# EAGLE board ME461_F28379D (EAGLE 7.7.0), part 1 of 2
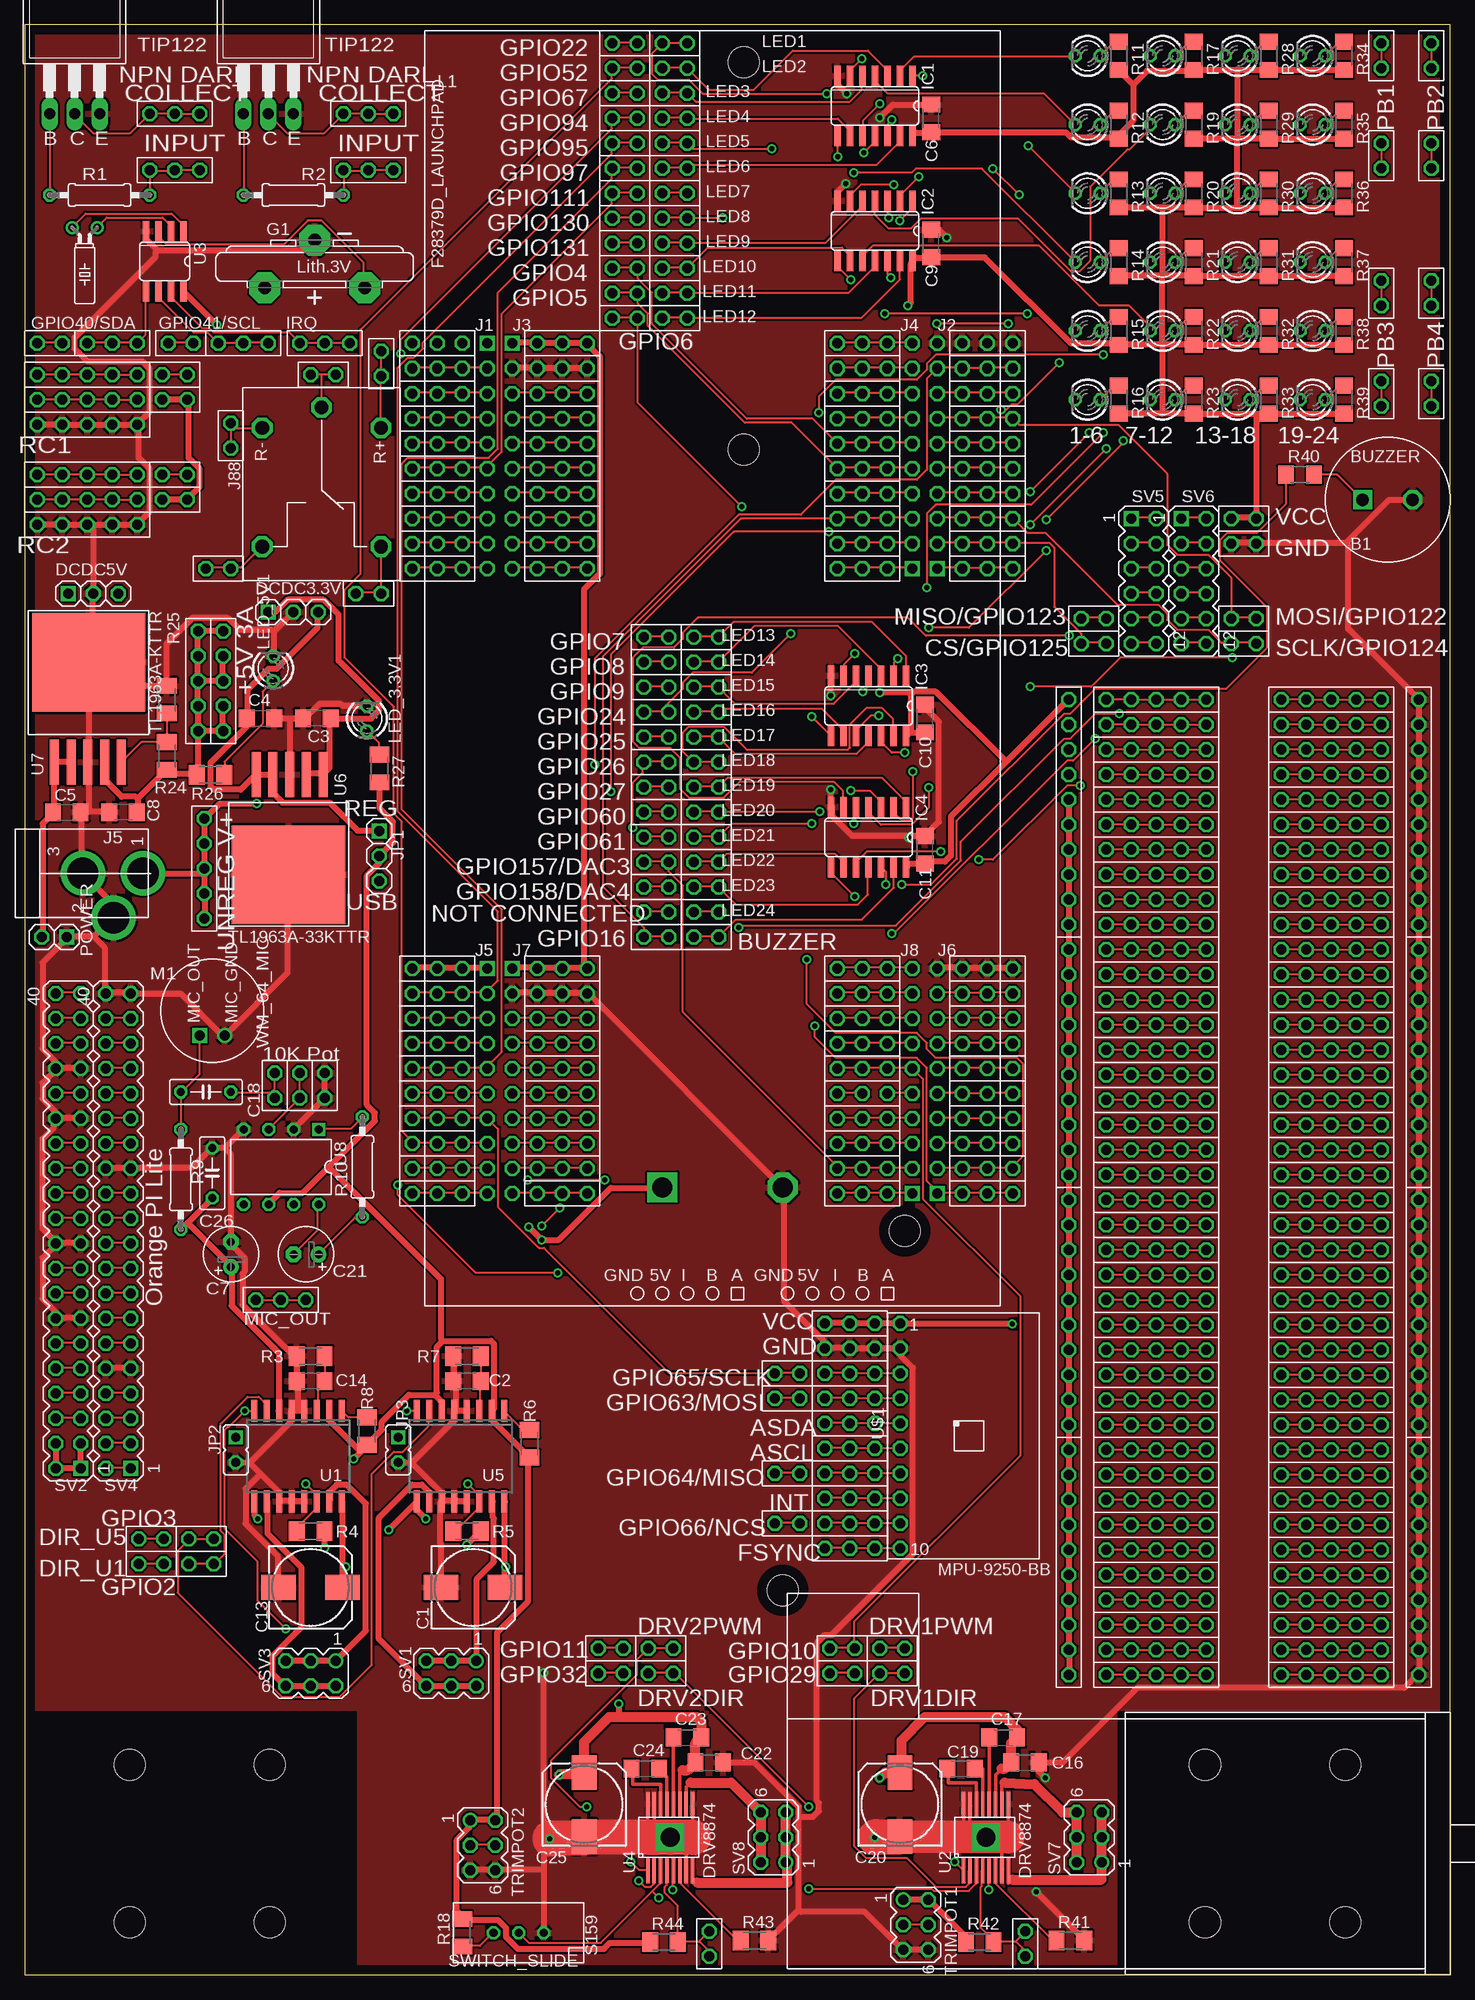
[diagram p5: board, top side]
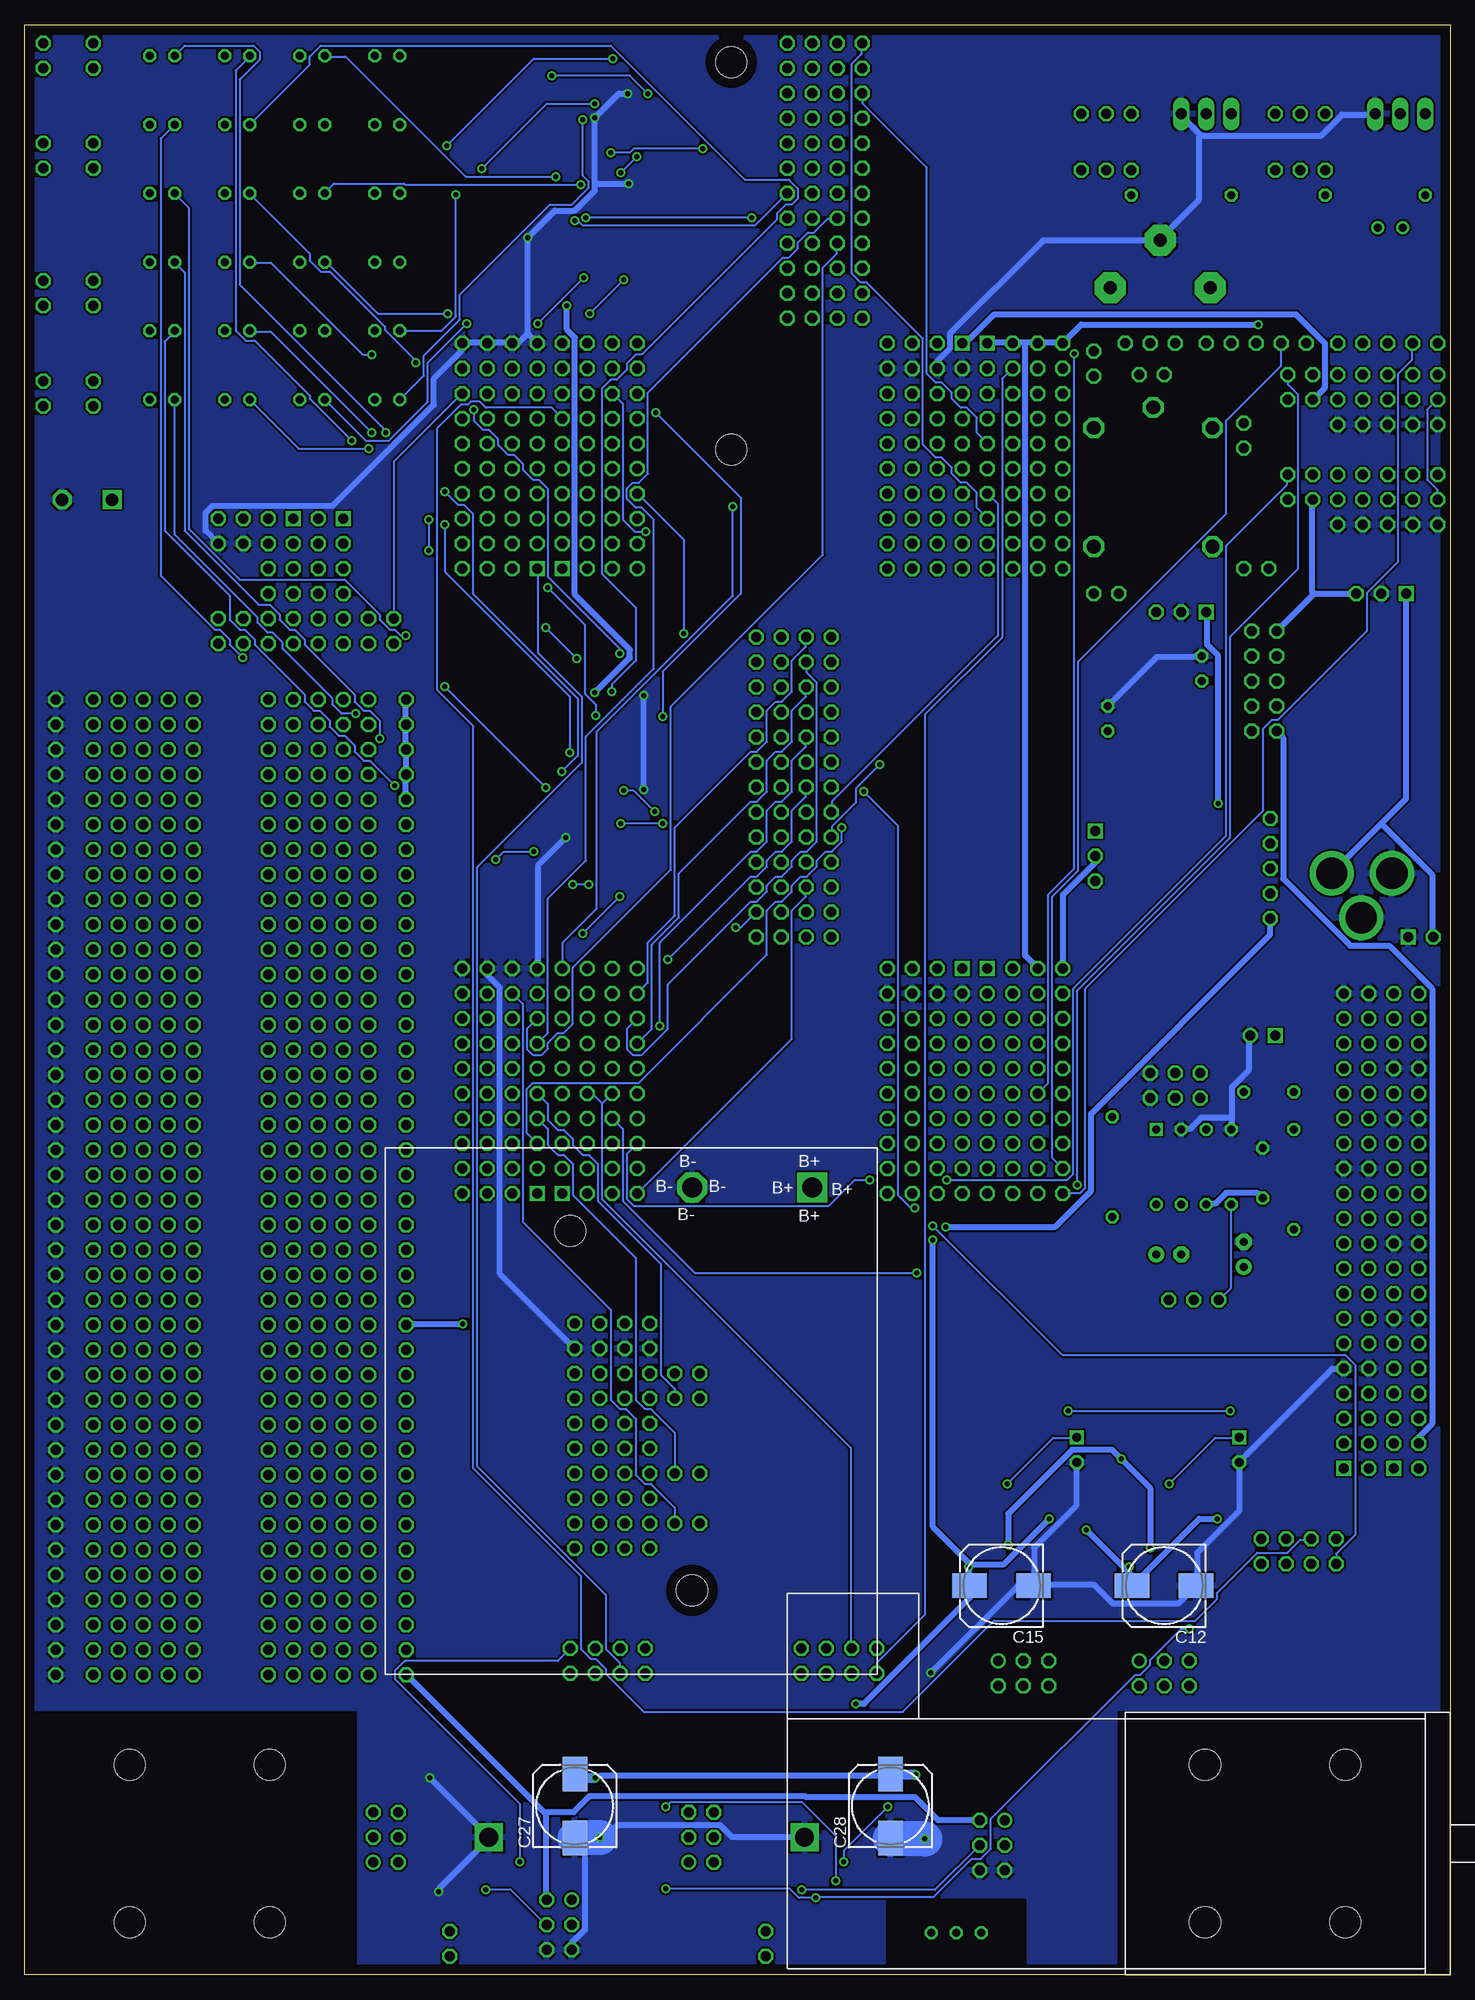
[diagram p6: board, bottom side, seen from below]

Size 144.78 x 198.12 mm. Coordinates in mm from the lower left corner, seen from the top.
Outline: 0,0 144.78,0 144.78,198.12 0,198.12 0,0
Copper layers (1*16): Top 0.035mm / dielectric 1.5mm / Bottom 0.035mm
Design rules "default *": minimum track width 7mil, minimum drill 20mil, track to track 8mil, track to pad 8mil, pad to pad 8mil, via to via 8mil, smd to smd 8mil, copper to edge 40mil, drill to drill 8mil, minimum pad ring 10mil, minimum via ring 8mil, stop-mask expansion 4mil, vias tented up to drill 20mil, thermal gap 10mil
Net classes: 0 default: width 0.203 mm, drill 0.508 mm, clearance 0.203 mm; 1 supply: width 0.61 mm, drill 0.508 mm, clearance 0.203 mm
tRestrict: area 0,0 to 33.7,26.7; area 111.1,0 to 144.8,26.7
bRestrict: area 43.2,0 to 57.1,7.6; area 111.1,0 to 144.8,26.7; area 0,0 to 33.7,26.7

## Footprints (pad centres in the part's own frame; a part is rotated, then mirrored left to right if it is on the bottom)
BUZZER = drill 1.27 square: P$1 -2.54,0 | drill 1.27 octagon: P$2 2.54,0
BATTERY_4AA_HOLDER = drill 2.032 square: P$1 0,0 | drill 2.032 octagon: P$2 12.224,0 | hole 3.175: 12.224,40.958; 24.606,4.445
153CLV-0810 = smd 3.5 x 2.5: + 3.25,0; - -3.25,0
C1206 = smd 1.6 x 1.8: 1 -1.4,0; 2 1.4,0
E2,5-6 = drill 0.813 pad 1.6: + -1.27,0 | drill 0.813 pad 1.6 octagon: - 1.27,0
C050-025X075 = drill 0.813 octagon: 1 -2.54,0; 2 2.54,0
1X03 = drill 1.016 square: 1 -2.54,0 | drill 1.016 octagon: 2 0,0; 3 2.54,0
CR2032V = drill 1.321 pad 3.15 octagon: + -2.54,-5.08; +@1 -2.54,5.08; - 2.286,0
SO14 = smd 0.66 x 2.032: 1 -3.81,-3.073; 2 -2.54,-3.073; 3 -1.27,-3.073; 4 0,-3.073; 5 1.27,-3.073; 6 2.54,-3.073; 7 3.81,-3.073; 8 3.81,3.073; 9 2.54,3.073; 10 1.27,3.073; 11 0,3.073; 12 -1.27,3.073; 13 -2.54,3.073; 14 -3.81,3.073
STRIP3 = drill 1.016 octagon: P$1 0,0; P$2 2.54,0; P$3 5.08,0
JACK-PMS = drill 3.175 pad 4.5: 1 -0.5,-3.31; 2 -5,-0.31; 3 -0.5,2.809
STRIP2 = drill 1.016 octagon: P$1 0,0; P$2 2.54,0
RELAY_JQC-3F_5V = drill 1.397 octagon: P$1 0,0; P$2 2.064,6.032; P$3 14.129,6.032; P$4 14.129,-6.032; P$5 2.064,-6.032
JP1 = drill 0.914 square: 1 0,-1.27 | drill 0.914 octagon: 2 0,1.27
F28379D_LAUNCHPAD = drill 1.016 square: P$1 -24.13,33.02; P$11 21.59,10.16; P$21 -21.59,33.02; P$31 19.05,10.16; P$41 -24.13,-30.48; P$51 21.59,-53.34; P$61 -21.59,-30.48; P$71 19.05,-53.34 | drill 1.016 octagon: P$2 -24.13,30.48; P$3 -24.13,27.94; P$4 -24.13,25.4; P$5 -24.13,22.86; P$6 -24.13,20.32; P$7 -24.13,17.78; P$8 -24.13,15.24; P$9 -24.13,12.7; P$10 -24.13,10.16; P$12 21.59,12.7; P$13 21.59,15.24; P$14 21.59,17.78; P$15 21.59,20.32; P$16 21.59,22.86; P$17 21.59,25.4; P$18 21.59,27.94; P$19 21.59,30.48; P$20 21.59,33.02; P$22 -21.59,30.48; P$23 -21.59,27.94; P$24 -21.59,25.4; P$25 -21.59,22.86; P$26 -21.59,20.32; P$27 -21.59,17.78; P$28 -21.59,15.24; P$29 -21.59,12.7; P$30 -21.59,10.16; P$32 19.05,12.7; P$33 19.05,15.24; P$34 19.05,17.78; P$35 19.05,20.32; P$36 19.05,22.86; P$37 19.05,25.4; P$38 19.05,27.94; P$39 19.05,30.48; P$40 19.05,33.02; P$42 -24.13,-33.02; P$43 -24.13,-35.56; P$44 -24.13,-38.1; P$45 -24.13,-40.64; P$46 -24.13,-43.18; P$47 -24.13,-45.72; P$48 -24.13,-48.26; P$49 -24.13,-50.8; P$50 -24.13,-53.34; P$52 21.59,-50.8; P$53 21.59,-48.26; P$54 21.59,-45.72; P$55 21.59,-43.18; P$56 21.59,-40.64; P$57 21.59,-38.1; P$58 21.59,-35.56; P$59 21.59,-33.02; P$60 21.59,-30.48; P$62 -21.59,-33.02; P$63 -21.59,-35.56; P$64 -21.59,-38.1; P$65 -21.59,-40.64; P$66 -21.59,-43.18; P$67 -21.59,-45.72; P$68 -21.59,-48.26; P$69 -21.59,-50.8; P$70 -21.59,-53.34; P$72 19.05,-50.8; P$73 19.05,-48.26; P$74 19.05,-45.72; P$75 19.05,-43.18; P$76 19.05,-40.64; P$77 19.05,-38.1; P$78 19.05,-35.56; P$79 19.05,-33.02; P$80 19.05,-30.48
LED3MM = drill 0.813 octagon: A -1.27,0; K 1.27,0
WM_64_MIC = drill 1.016 square: P$1 0,0 | drill 1.016: P$2 2.54,0
1X02 = drill 1.016 square: 1 -1.27,0 | drill 1.016 octagon: 2 1.27,0
TC26H = drill 0.813: 1 -1.27,0; 2 1.27,0
0207/10 = drill 0.813 octagon: 1 -5.08,0; 2 5.08,0
M1206 = smd 1.6 x 2: 1 -1.4,0; 2 1.4,0
R1206 = smd 1.6 x 1.803: 1 -1.422,0; 2 1.422,0
STRIP5 = drill 1.016 octagon: P$1 0,0; P$2 2.54,0; P$3 5.08,0; P$4 7.62,0; P$5 10.16,0
STRIP10 = drill 1.016 octagon: P$1 0,0; P$2 2.54,0; P$3 5.08,0; P$4 7.62,0; P$5 10.16,0; P$6 12.7,0; P$7 15.24,0; P$8 17.78,0; P$9 20.32,0; P$10 22.86,0
SWITCH_SLIDE = drill 0.813 octagon: P$1 0,-5.08; P$2 0,-2.54; P$3 0,0
MA03-2 = drill 1.016: 1 -2.54,-1.27 | drill 1.016 octagon: 2 -2.54,1.27; 3 0,-1.27; 4 0,1.27; 5 2.54,-1.27; 6 2.54,1.27
MA20-2 = drill 1.016 square: 1 -24.13,-1.27 | drill 1.016 octagon: 2 -24.13,1.27; 3 -21.59,-1.27; 4 -21.59,1.27; 5 -19.05,-1.27; 6 -19.05,1.27; 7 -16.51,-1.27; 8 -16.51,1.27; 9 -13.97,-1.27; 10 -13.97,1.27; 11 -11.43,-1.27; 12 -11.43,1.27; 13 -8.89,-1.27; 14 -8.89,1.27; 15 -6.35,-1.27; 16 -6.35,1.27; 17 -3.81,-1.27; 18 -3.81,1.27; 19 -1.27,-1.27; 20 -1.27,1.27; 21 1.27,-1.27; 22 1.27,1.27; 23 3.81,-1.27; 24 3.81,1.27; 25 6.35,-1.27; 26 6.35,1.27; 27 8.89,-1.27; 28 8.89,1.27; 29 11.43,-1.27; 30 11.43,1.27; 31 13.97,-1.27; 32 13.97,1.27; 33 16.51,-1.27; 34 16.51,1.27; 35 19.05,-1.27; 36 19.05,1.27; 37 21.59,-1.27; 38 21.59,1.27; 39 24.13,-1.27; 40 24.13,1.27
MA06-2 = drill 1.016 square: 1 -6.35,-1.27 | drill 1.016 octagon: 2 -6.35,1.27; 3 -3.81,-1.27; 4 -3.81,1.27; 5 -1.27,-1.27; 6 -1.27,1.27; 7 1.27,-1.27; 8 1.27,1.27; 9 3.81,-1.27; 10 3.81,1.27; 11 6.35,-1.27; 12 6.35,1.27
TO220 = drill 1.118 long: 1 -2.54,-6.35; 2 0,-6.35; 3 2.54,-6.35
SO16W = smd 0.6 x 2.2: 1 -4.445,-4.6; 2 -3.175,-4.6; 3 -1.905,-4.6; 4 -0.635,-4.6; 5 0.635,-4.6; 6 1.905,-4.6; 7 3.175,-4.6; 8 4.445,-4.6; 9 4.445,4.6; 10 3.175,4.6; 11 1.905,4.6; 12 0.635,4.6; 13 -0.635,4.6; 14 -1.905,4.6; 15 -3.175,4.6; 16 -4.445,4.6
HTSSOP16 = smd 2.5 x 0.35: P$1 -3.4,2.275; P$2 -3.4,1.625; P$3 -3.4,0.975; P$4 -3.4,0.325; P$5 -3.4,-0.325; P$6 -3.4,-0.975; P$7 -3.4,-1.625; P$8 -3.4,-2.275; P$9 3.4,-2.275; P$10 3.4,-1.625; P$11 3.4,-0.975; P$12 3.4,-0.325; P$13 3.4,0.325; P$14 3.4,0.975; P$15 3.4,1.625; P$16 3.4,2.275 | drill 1.905 pad 2.54 square: P$17 0,0
SO08 = smd 0.66 x 2.032: 1 -1.905,-3.073; 2 -0.635,-3.073; 3 0.635,-3.073; 4 1.905,-3.073; 5 1.905,3.073; 6 0.635,3.073; 7 -0.635,3.073; 8 -1.905,3.073
TL1963AKTTR = smd 0.914 x 4.572: P$1 -3.81,-10.16; P$2 -2.108,-10.16; P$3 -0.406,-10.16; P$4 1.295,-10.16; P$5 2.997,-10.16 | smd 11.5 x 10: P$6 -0.3,0
DIL08 = drill 0.813 square: 1 -3.81,-3.81 | drill 0.813 octagon: 2 -1.27,-3.81; 3 1.27,-3.81; 4 3.81,-3.81; 5 3.81,3.81; 6 1.27,3.81; 7 -1.27,3.81; 8 -3.81,3.81
MPU-9250-BB = drill 1.016 octagon: 1 -11.434,-6.96; 2 -8.894,-6.96; 3 -6.354,-6.96; 4 -3.814,-6.96; 5 -1.274,-6.96; 6 1.266,-6.96; 7 3.806,-6.96; 8 6.346,-6.96; 9 8.886,-6.96; 10 11.426,-6.96
GEARMOTOR_MOUNT = hole 3.175: 7.112,8.001; -7.112,8.001; -7.112,-8.001; 7.112,-8.001
CASTERWHEEL = hole 3.175: 19.685,0; -19.685,0

## Placement (x,y rotation side)
B1  BUZZER  [BUZZER]  138.43,149.86 0 top
B2  BATTERY_4AA_HOLDER  [BATTERY_4AA_HOLDER]  64.77,80.01 180 bottom
C1  47uF  [153CLV-0810]  45.56,39.36 0 top
C2  680pF  [C1206]  44.92,60.32 180 top
C3  10 uF  [C1206]  29.68,127.64 180 top
C4  10 uF  [C1206]  23.96,127.64 0 top
C5  10 uF  [C1206]  4.28,118.12 0 top
C6  0.1uf  [C1206]  92.08,188.59 90 top
C7  10uF  [E2,5-6]  20.96,73.19 90 top
C8  10 uF  [C1206]  9.99,118.12 180 top
C9  0.1uf  [C1206]  92.08,175.9 90 top
C10  0.1uf  [C1206]  91.44,127.64 90 top
C11  0.1uf  [C1206]  91.44,114.3 90 top
C12  47uF  [153CLV-0810]  29.05,39.53 180 bottom
C13  47uF  [153CLV-0810]  29.05,39.36 0 top
C14  680pF  [C1206]  29.05,60.32 180 top
C15  47uF  [153CLV-0810]  45.56,39.53 180 bottom
C16  0.1uF  [C1206]  101.6,21.59 0 top
C17  0.1uF  [C1206]  99.38,24.13 0 top
C18  0.22uF  [C050-025X075]  18.42,89.7 0 top
C19  22nF  [C1206]  95.09,20.95 0 top
C20  47uF  [153CLV-0810]  88.9,17.3 90 top
C21  10uF  [E2,5-6]  28.58,73.19 180 top
C22  0.1uF  [C1206]  69.53,21.59 0 top
C23  0.1uF  [C1206]  67.31,24.13 0 top
C24  22nF  [C1206]  63.02,20.95 0 top
C25  47uF  [153CLV-0810]  56.83,17.3 90 top
C26  0.1uF  [C050-025X075]  19.06,81.45 90 top
C27  47uF  [153CLV-0810]  88.9,17.14 90 bottom
C28  47uF  [153CLV-0810]  56.83,17.14 90 bottom
DCDC3.3V  [1X03]  27.3,138.43 0 top
DCDC5V  [1X03]  6.99,140.34 0 top
G1  CR2032V  [CR2032V]  29.46,173.95 90 top
IC1  7404D  [SO14]  86.36,189.87 180 top
IC2  7404D  [SO14]  86.36,177.16 180 top
IC3  7404D  [SO14]  85.72,128.91 180 top
IC4  7404D  [SO14]  85.72,115.57 180 top
J1  STRIP3  [STRIP3]  27.94,165.74 0 top
J2  STRIP3  [STRIP3]  19.68,165.74 0 top
J3  STRIP3  [STRIP3]  6.35,165.74 0 top
J4  STRIP3  [STRIP3]  12.69,189.06 0 top
J5  [JACK-PMS]  8.72,112.4 90 top
J6  STRIP3  [STRIP3]  12.69,183.35 0 top
J7  STRIP2  [STRIP2]  25.41,91.61 270 top
J8  STRIP2  [STRIP2]  27.95,91.61 270 top
J9  STRIP2  [STRIP2]  30.49,91.61 270 top
J10  STRIP3  [STRIP3]  39.37,165.74 0 top
J11  STRIP2  [STRIP2]  64.77,178.44 0 top
J12  STRIP2  [STRIP2]  64.77,175.9 0 top
J13  STRIP2  [STRIP2]  64.77,173.35 0 top
J14  STRIP3  [STRIP3]  39.37,163.19 0 top
J15  STRIP3  [STRIP3]  39.37,160.66 0 top
J16  STRIP3  [STRIP3]  39.37,158.12 0 top
J17  STRIP3  [STRIP3]  39.37,155.57 0 top
J18  STRIP3  [STRIP3]  39.37,153.03 0 top
J19  STRIP3  [STRIP3]  39.37,150.5 0 top
J20  STRIP3  [STRIP3]  39.37,147.96 0 top
J21  STRIP3  [STRIP3]  39.37,145.41 0 top
J22  STRIP2  [STRIP2]  64.77,170.81 0 top
J23  STRIP3  [STRIP3]  32.38,189.06 0 top
J24  STRIP3  [STRIP3]  32.38,183.35 0 top
J25  STRIP2  [STRIP2]  64.77,168.28 0 top
J26  STRIP2  [STRIP2]  64.77,180.97 0 top
J27  STRIP2  [STRIP2]  67.94,133.35 0 top
J28  STRIP3  [STRIP3]  39.37,142.88 0 top
J29  STRIP3  [STRIP3]  95.25,142.88 0 top
J30  STRIP3  [STRIP3]  95.25,145.41 0 top
J31  STRIP3  [STRIP3]  95.25,147.96 0 top
J32  STRIP3  [STRIP3]  95.25,150.5 0 top
J33  STRIP3  [STRIP3]  95.25,153.03 0 top
J34  STRIP2  [STRIP2]  67.94,130.81 0 top
J49  STRIP3  [STRIP3]  28.57,68.58 180 top
J62  STRIP2  [STRIP2]  67.94,107.95 0 top
J63  STRIP2  [STRIP2]  62.87,107.95 0 top
J64  STRIP2  [STRIP2]  122.56,145.41 0 top
J65  STRIP2  [STRIP2]  122.56,147.96 0 top
J66  STRIP2  [STRIP2]  122.56,137.79 0 top
J67  STRIP2  [STRIP2]  107.31,137.79 0 top
J68  STRIP2  [STRIP2]  122.56,135.25 0 top
J69  STRIP2  [STRIP2]  107.31,135.25 0 top
J70  STRIP2  [STRIP2]  137.79,183.51 90 top
J71  STRIP2  [STRIP2]  137.79,193.68 90 top
J72  STRIP2  [STRIP2]  142.88,183.51 90 top
J73  STRIP2  [STRIP2]  142.88,193.68 90 top
J74  STRIP2  [STRIP2]  137.79,159.38 90 top
J75  STRIP2  [STRIP2]  137.79,169.54 90 top
J76  STRIP2  [STRIP2]  142.88,159.38 90 top
J77  STRIP2  [STRIP2]  142.88,169.54 90 top
J78  STRIP2  [STRIP2]  101.6,4.45 270 top
J79  STRIP2  [STRIP2]  86.84,33.18 0 top
J80  STRIP2  [STRIP2]  86.84,30.64 0 top
J81  STRIP2  [STRIP2]  69.53,4.45 270 top
J82  STRIP2  [STRIP2]  63.34,33.18 0 top
J83  STRIP2  [STRIP2]  63.34,30.64 0 top
J84  STRIP2  [STRIP2]  81.76,33.18 0 top
J85  STRIP2  [STRIP2]  81.76,30.64 0 top
J86  STRIP2  [STRIP2]  58.26,33.18 0 top
J87  STRIP2  [STRIP2]  58.26,30.64 0 top
J88  RELAY_JQC-3F_5V  [RELAY_JQC-3F_5V]  30.16,159.23 270 top
J89  STRIP2  [STRIP2]  36.2,164.94 270 top
J90  STRIP2  [STRIP2]  20.95,157.64 270 top
J91  STRIP2  [STRIP2]  29.05,162.56 0 top
J92  STRIP2  [STRIP2]  33.66,140.34 0 top
J93  STRIP2  [STRIP2]  18.41,142.88 0 top
J98  STRIP3  [STRIP3]  95.25,155.57 0 top
J99  STRIP3  [STRIP3]  95.25,158.12 0 top
J100  STRIP3  [STRIP3]  95.25,160.66 0 top
J101  STRIP3  [STRIP3]  95.25,163.19 0 top
J102  STRIP3  [STRIP3]  95.25,165.74 0 top
J103  STRIP3  [STRIP3]  52.07,165.74 0 top
J104  STRIP3  [STRIP3]  52.07,163.19 0 top
J105  STRIP3  [STRIP3]  52.07,160.66 0 top
J106  STRIP3  [STRIP3]  52.07,158.12 0 top
J107  STRIP3  [STRIP3]  52.07,155.57 0 top
J108  STRIP3  [STRIP3]  52.07,153.03 0 top
J109  STRIP3  [STRIP3]  52.07,150.5 0 top
J110  STRIP3  [STRIP3]  52.07,147.96 0 top
J111  STRIP3  [STRIP3]  52.07,145.41 0 top
J112  STRIP3  [STRIP3]  52.07,142.88 0 top
J113  STRIP3  [STRIP3]  82.55,142.88 0 top
J114  STRIP3  [STRIP3]  82.55,145.41 0 top
J115  STRIP3  [STRIP3]  82.55,147.96 0 top
J116  STRIP3  [STRIP3]  82.55,150.5 0 top
J117  STRIP3  [STRIP3]  82.55,153.03 0 top
J118  STRIP3  [STRIP3]  82.55,155.57 0 top
J119  STRIP3  [STRIP3]  82.55,158.12 0 top
J120  STRIP3  [STRIP3]  82.55,160.66 0 top
J121  STRIP3  [STRIP3]  82.55,163.19 0 top
J122  STRIP3  [STRIP3]  82.55,165.74 0 top
J123  STRIP3  [STRIP3]  81.28,66.2 0 top
J124  STRIP3  [STRIP3]  81.28,63.66 0 top
J125  STRIP3  [STRIP3]  81.28,61.12 0 top
J126  STRIP3  [STRIP3]  81.28,58.58 0 top
J127  STRIP3  [STRIP3]  81.28,56.04 0 top
J128  STRIP3  [STRIP3]  81.28,53.5 0 top
J129  STRIP3  [STRIP3]  81.28,50.96 0 top
J130  STRIP3  [STRIP3]  81.28,48.42 0 top
J131  STRIP3  [STRIP3]  81.28,45.88 0 top
J132  STRIP3  [STRIP3]  81.28,43.34 0 top
J133  STRIP3  [STRIP3]  82.55,102.23 0 top
J134  STRIP3  [STRIP3]  82.55,99.69 0 top
J135  STRIP3  [STRIP3]  82.55,97.16 0 top
J136  STRIP3  [STRIP3]  82.55,94.61 0 top
J137  STRIP3  [STRIP3]  82.55,92.08 0 top
J138  STRIP3  [STRIP3]  82.55,89.53 0 top
J139  STRIP3  [STRIP3]  82.55,87 0 top
J140  STRIP3  [STRIP3]  82.55,84.45 0 top
J141  STRIP3  [STRIP3]  82.55,81.92 0 top
J142  STRIP3  [STRIP3]  82.55,79.38 0 top
J143  STRIP3  [STRIP3]  52.07,79.38 0 top
J144  STRIP3  [STRIP3]  52.07,81.92 0 top
J145  STRIP3  [STRIP3]  52.07,84.45 0 top
J146  STRIP3  [STRIP3]  52.07,87 0 top
J147  STRIP3  [STRIP3]  52.07,89.53 0 top
J148  STRIP3  [STRIP3]  52.07,92.08 0 top
J149  STRIP3  [STRIP3]  52.07,94.61 0 top
J150  STRIP3  [STRIP3]  52.07,97.16 0 top
J151  STRIP3  [STRIP3]  52.07,99.69 0 top
J152  STRIP3  [STRIP3]  52.07,102.23 0 top
J153  STRIP3  [STRIP3]  95.25,102.23 0 top
J154  STRIP3  [STRIP3]  95.25,99.69 0 top
J155  STRIP3  [STRIP3]  95.25,97.16 0 top
J156  STRIP3  [STRIP3]  95.25,94.61 0 top
J157  STRIP3  [STRIP3]  95.25,92.08 0 top
J158  STRIP3  [STRIP3]  95.25,89.53 0 top
J159  STRIP3  [STRIP3]  95.25,87 0 top
J160  STRIP3  [STRIP3]  95.25,84.45 0 top
J161  STRIP3  [STRIP3]  95.25,81.92 0 top
J162  STRIP3  [STRIP3]  95.25,79.38 0 top
J163  STRIP3  [STRIP3]  39.37,79.38 0 top
J164  STRIP3  [STRIP3]  39.37,81.92 0 top
J165  STRIP3  [STRIP3]  39.37,84.45 0 top
J166  STRIP3  [STRIP3]  39.37,87 0 top
J167  STRIP3  [STRIP3]  39.37,89.53 0 top
J168  STRIP3  [STRIP3]  39.37,92.08 0 top
J169  STRIP3  [STRIP3]  39.37,94.61 0 top
J170  STRIP3  [STRIP3]  39.37,97.16 0 top
J176  STRIP3  [STRIP3]  39.37,99.69 0 top
J177  STRIP3  [STRIP3]  39.37,102.23 0 top
J178  STRIP2  [STRIP2]  64.77,196.22 0 top
J179  STRIP2  [STRIP2]  64.77,193.68 0 top
J180  STRIP2  [STRIP2]  64.77,191.13 0 top
J182  STRIP2  [STRIP2]  64.77,188.59 0 top
J183  STRIP2  [STRIP2]  64.77,186.06 0 top
J184  STRIP2  [STRIP2]  64.77,183.51 0 top
J186  STRIP2  [STRIP2]  67.94,128.27 0 top
J187  STRIP2  [STRIP2]  67.94,125.73 0 top
J188  STRIP2  [STRIP2]  67.94,123.19 0 top
J189  STRIP2  [STRIP2]  67.94,135.89 0 top
J190  STRIP2  [STRIP2]  67.94,118.11 0 top
J191  STRIP2  [STRIP2]  67.94,115.57 0 top
J192  STRIP2  [STRIP2]  67.94,113.03 0 top
J193  STRIP2  [STRIP2]  67.94,110.49 0 top
J194  STRIP2  [STRIP2]  67.94,105.41 0 top
J195  STRIP2  [STRIP2]  67.94,120.65 0 top
J196  STRIP2  [STRIP2]  16.67,41.75 0 top
J197  STRIP2  [STRIP2]  16.67,44.29 0 top
J198  STRIP2  [STRIP2]  11.59,41.75 0 top
J199  STRIP2  [STRIP2]  11.59,44.29 0 top
J200  STRIP2  [STRIP2]  13.97,160.02 0 top
J201  STRIP2  [STRIP2]  13.97,162.56 0 top
J202  STRIP2  [STRIP2]  13.97,152.4 0 top
J203  STRIP2  [STRIP2]  13.97,149.86 0 top
J204  STRIP2  [STRIP2]  76.2,58.58 0 top
J205  STRIP2  [STRIP2]  76.2,50.96 0 top
J206  STRIP2  [STRIP2]  76.2,61.12 0 top
J207  STRIP2  [STRIP2]  76.2,45.88 0 top
J208  STRIP2  [STRIP2]  1.27,165.74 0 top
J209  STRIP2  [STRIP2]  14.61,165.74 0 top
J210  STRIP2  [STRIP2]  59.69,196.22 0 top
J211  STRIP2  [STRIP2]  59.69,193.68 0 top
J232  STRIP2  [STRIP2]  59.69,191.13 0 top
J233  STRIP2  [STRIP2]  59.69,188.59 0 top
J234  STRIP2  [STRIP2]  59.69,183.51 0 top
J235  STRIP2  [STRIP2]  59.69,180.97 0 top
J236  STRIP2  [STRIP2]  59.69,178.44 0 top
J237  STRIP2  [STRIP2]  59.69,175.9 0 top
J238  STRIP2  [STRIP2]  59.69,173.35 0 top
J239  STRIP2  [STRIP2]  59.69,170.81 0 top
J240  STRIP2  [STRIP2]  59.69,168.28 0 top
J241  STRIP2  [STRIP2]  59.69,186.06 0 top
J242  STRIP2  [STRIP2]  62.87,135.89 0 top
J243  STRIP2  [STRIP2]  62.87,133.35 0 top
J244  STRIP2  [STRIP2]  62.87,130.81 0 top
J245  STRIP2  [STRIP2]  62.87,128.27 0 top
J246  STRIP2  [STRIP2]  62.87,125.73 0 top
J247  STRIP2  [STRIP2]  62.87,123.19 0 top
J248  STRIP2  [STRIP2]  62.87,120.65 0 top
J249  STRIP2  [STRIP2]  62.87,118.11 0 top
J250  STRIP2  [STRIP2]  62.87,115.57 0 top
J251  STRIP2  [STRIP2]  62.87,105.41 0 top
J252  STRIP2  [STRIP2]  62.87,113.03 0 top
J253  STRIP2  [STRIP2]  62.87,110.49 0 top
JP1  VSEL  [1X03]  36.03,113.67 270 top
JP2  [JP1]  21.43,53.33 180 top
JP3  [JP1]  37.94,53.33 180 top
L1  F28379D_LAUNCHPAD  [F28379D_LAUNCHPAD]  71.12,132.72 0 top
LED1  [LED3MM]  107.95,194.94 180 top
LED2  [LED3MM]  107.95,187.96 180 top
LED3  [LED3MM]  107.95,180.97 180 top
LED4  [LED3MM]  107.95,173.99 180 top
LED5  [LED3MM]  107.95,167 180 top
LED6  [LED3MM]  107.95,160.02 180 top
LED7  [LED3MM]  115.57,194.94 180 top
LED8  [LED3MM]  115.57,187.96 180 top
LED9  [LED3MM]  115.57,180.97 180 top
LED10  [LED3MM]  115.57,173.99 180 top
LED11  [LED3MM]  115.57,167 180 top
LED12  [LED3MM]  115.57,160.02 180 top
LED13  [LED3MM]  123.19,194.94 180 top
LED14  [LED3MM]  123.19,187.96 180 top
LED15  [LED3MM]  123.19,180.97 180 top
LED16  [LED3MM]  123.19,173.99 180 top
LED17  [LED3MM]  123.19,167 180 top
LED18  [LED3MM]  123.19,160.02 180 top
LED19  [LED3MM]  130.81,194.94 180 top
LED20  [LED3MM]  130.81,187.96 180 top
LED21  [LED3MM]  130.81,180.97 180 top
LED22  [LED3MM]  130.81,173.99 180 top
LED23  [LED3MM]  130.81,167 180 top
LED24  [LED3MM]  130.81,160.02 180 top
LED_3.3V1  [LED3MM]  34.76,127.64 90 top
LED_5V1  [LED3MM]  25.23,132.72 90 top
M1  WM_64_MIC  [WM_64_MIC]  17.79,95.42 0 top
POWER  [1X02]  3.01,105.42 180 top
Q1  32.768KHz  [TC26H]  6.09,177.51 180 top
R1  R_B  [0207/10]  7.61,180.81 180 top
R2  R_B  [0207/10]  27.3,180.81 180 top
R3  24.9K  [M1206]  29.05,62.86 0 top
R4  2.2K  [M1206]  29.05,45.08 0 top
R5  2.2K  [M1206]  44.92,45.08 0 top
R6  2.2K  [M1206]  51.27,53.97 270 top
R7  24.9K  [M1206]  44.92,62.86 0 top
R8  2.2K  [M1206]  34.76,55.24 270 top
R9  2.2K  [0207/10]  15.88,80.81 90 top
R10  1.2K  [0207/10]  34.3,82.08 90 top
R11  [R1206]  111.12,194.94 270 top
R12  [R1206]  111.12,187.96 270 top
R13  [R1206]  111.12,180.97 270 top
R14  [R1206]  111.12,173.99 270 top
R15  [R1206]  111.12,167 270 top
R16  [R1206]  111.12,160.02 270 top
R17  [R1206]  118.75,194.94 270 top
R18  2.2K  [M1206]  44.44,4.28 90 top
R19  [R1206]  118.75,187.96 270 top
R20  [R1206]  118.75,180.97 270 top
R21  [R1206]  118.75,173.99 270 top
R22  [R1206]  118.75,167 270 top
R23  [R1206]  118.75,160.02 270 top
R24  1500  [M1206]  14.44,123.83 270 top
R25  470  [M1206]  14.44,129.55 270 top
R26  470  [M1206]  18.88,121.93 180 top
R27  220  [M1206]  36.03,122.56 270 top
R28  [R1206]  126.36,194.94 270 top
R29  [R1206]  126.36,187.96 270 top
R30  [R1206]  126.36,180.97 270 top
R31  [R1206]  126.36,173.99 270 top
R32  [R1206]  126.36,167 270 top
R33  [R1206]  126.36,160.02 270 top
R34  [R1206]  133.99,194.94 270 top
R35  [R1206]  133.99,187.96 270 top
R36  [R1206]  133.99,180.97 270 top
R37  [R1206]  133.99,173.99 270 top
R38  [R1206]  133.99,167 270 top
R39  [R1206]  133.99,160.02 270 top
R40  100  [R1206]  129.54,152.4 0 top
R41  1.8K  [M1206]  106.2,3.49 0 top
R42  10K  [M1206]  97,3.33 0 top
R43  1.8K  [M1206]  74.14,3.49 0 top
R44  10K  [M1206]  64.93,3.33 0 top
S17  STRIP5  [STRIP5]  20.15,126.37 90 top
S18  STRIP5  [STRIP5]  17.61,126.37 90 top
S20  STRIP10  [STRIP10]  141.6,30.48 90 top
S24  STRIP10  [STRIP10]  141.6,55.88 90 top
S27  STRIP10  [STRIP10]  141.6,106.68 90 top
S28  STRIP10  [STRIP10]  141.6,81.28 90 top
S42  STRIP10  [STRIP10]  106.05,106.68 90 top
S50  STRIP10  [STRIP10]  106.05,81.28 90 top
S53  STRIP10  [STRIP10]  106.05,30.48 90 top
S58  STRIP10  [STRIP10]  106.05,55.88 90 top
S91  STRIP5  [STRIP5]  109.86,129.54 0 top
S92  STRIP5  [STRIP5]  109.86,127 0 top
S93  STRIP5  [STRIP5]  109.86,124.46 0 top
S94  STRIP5  [STRIP5]  109.86,121.92 0 top
S95  STRIP5  [STRIP5]  109.86,119.38 0 top
S96  STRIP5  [STRIP5]  109.86,116.84 0 top
S97  STRIP5  [STRIP5]  109.86,114.3 0 top
S98  STRIP5  [STRIP5]  109.86,111.76 0 top
S99  STRIP5  [STRIP5]  109.86,109.22 0 top
S101  STRIP5  [STRIP5]  109.86,106.68 0 top
S105  STRIP5  [STRIP5]  109.86,104.14 0 top
S108  STRIP5  [STRIP5]  109.86,101.6 0 top
S129  STRIP5  [STRIP5]  11.43,157.48 180 top
S130  STRIP5  [STRIP5]  11.43,162.56 180 top
S137  STRIP5  [STRIP5]  11.43,147.32 180 top
S138  STRIP5  [STRIP5]  11.43,152.4 180 top
S139  STRIP5  [STRIP5]  11.43,149.86 180 top
S140  STRIP5  [STRIP5]  109.86,99.06 0 top
S141  STRIP5  [STRIP5]  18.25,107.32 90 top
S147  STRIP5  [STRIP5]  11.43,160.02 180 top
S159  SWITCH_SLIDE  [SWITCH_SLIDE]  47.62,4.28 90 top
S160  STRIP5  [STRIP5]  109.86,96.52 0 top
S161  STRIP5  [STRIP5]  109.86,93.98 0 top
S162  STRIP5  [STRIP5]  109.86,91.44 0 top
S163  STRIP5  [STRIP5]  109.86,88.9 0 top
S164  STRIP5  [STRIP5]  109.86,86.36 0 top
S165  STRIP5  [STRIP5]  109.86,83.82 0 top
S166  STRIP5  [STRIP5]  109.86,81.28 0 top
S167  STRIP5  [STRIP5]  109.86,78.74 0 top
S168  STRIP5  [STRIP5]  109.86,76.2 0 top
S169  STRIP5  [STRIP5]  109.86,73.66 0 top
S170  STRIP5  [STRIP5]  109.86,71.12 0 top
S171  STRIP5  [STRIP5]  109.86,68.58 0 top
S172  STRIP5  [STRIP5]  109.86,66.04 0 top
S173  STRIP5  [STRIP5]  109.86,63.5 0 top
S174  STRIP5  [STRIP5]  109.86,60.96 0 top
S175  STRIP5  [STRIP5]  109.86,58.42 0 top
S176  STRIP5  [STRIP5]  109.86,55.88 0 top
S177  STRIP5  [STRIP5]  109.86,53.34 0 top
S178  STRIP5  [STRIP5]  109.86,50.8 0 top
S179  STRIP5  [STRIP5]  109.86,48.26 0 top
S180  STRIP5  [STRIP5]  109.86,45.72 0 top
S181  STRIP5  [STRIP5]  109.86,43.18 0 top
S182  STRIP5  [STRIP5]  109.86,40.64 0 top
S183  STRIP5  [STRIP5]  109.86,38.1 0 top
S184  STRIP5  [STRIP5]  109.86,35.56 0 top
S185  STRIP5  [STRIP5]  109.86,33.02 0 top
S186  STRIP5  [STRIP5]  109.86,30.48 0 top
S187  STRIP5  [STRIP5]  127.64,30.48 0 top
S188  STRIP5  [STRIP5]  127.64,35.56 0 top
S189  STRIP5  [STRIP5]  127.64,33.02 0 top
S190  STRIP5  [STRIP5]  127.64,129.54 0 top
S191  STRIP5  [STRIP5]  127.64,127 0 top
S192  STRIP5  [STRIP5]  127.64,124.46 0 top
S193  STRIP5  [STRIP5]  127.64,121.92 0 top
S194  STRIP5  [STRIP5]  127.64,119.38 0 top
S195  STRIP5  [STRIP5]  127.64,116.84 0 top
S196  STRIP5  [STRIP5]  127.64,114.3 0 top
S197  STRIP5  [STRIP5]  127.64,111.76 0 top
S198  STRIP5  [STRIP5]  127.64,109.22 0 top
S199  STRIP5  [STRIP5]  127.64,106.68 0 top
S200  STRIP5  [STRIP5]  127.64,104.14 0 top
S201  STRIP5  [STRIP5]  127.64,101.6 0 top
S202  STRIP5  [STRIP5]  127.64,99.06 0 top
S203  STRIP5  [STRIP5]  127.64,96.52 0 top
S204  STRIP5  [STRIP5]  127.64,93.98 0 top
S205  STRIP5  [STRIP5]  127.64,91.44 0 top
S206  STRIP5  [STRIP5]  127.64,88.9 0 top
S207  STRIP5  [STRIP5]  127.64,86.36 0 top
S208  STRIP5  [STRIP5]  127.64,83.82 0 top
S209  STRIP5  [STRIP5]  127.64,81.28 0 top
S210  STRIP5  [STRIP5]  127.64,78.74 0 top
S211  STRIP5  [STRIP5]  127.64,76.2 0 top
S212  STRIP5  [STRIP5]  127.64,73.66 0 top
S213  STRIP5  [STRIP5]  127.64,71.12 0 top
S214  STRIP5  [STRIP5]  127.64,68.58 0 top
S215  STRIP5  [STRIP5]  127.64,66.04 0 top
S216  STRIP5  [STRIP5]  127.64,63.5 0 top
S217  STRIP5  [STRIP5]  127.64,60.96 0 top
S218  STRIP5  [STRIP5]  127.64,58.42 0 top
S219  STRIP5  [STRIP5]  127.64,55.88 0 top
S220  STRIP5  [STRIP5]  127.64,53.34 0 top
S221  STRIP5  [STRIP5]  127.64,50.8 0 top
S222  STRIP5  [STRIP5]  127.64,48.26 0 top
S223  STRIP5  [STRIP5]  127.64,45.72 0 top
S224  STRIP5  [STRIP5]  127.64,43.18 0 top
S225  STRIP5  [STRIP5]  127.64,40.64 0 top
S226  STRIP5  [STRIP5]  127.64,38.1 0 top
SV1  [MA03-2]  43.33,30.63 180 top
SV2  [MA20-2]  4.45,75.56 90 top
SV3  [MA03-2]  29.05,30.63 180 top
SV4  [MA20-2]  9.53,75.56 90 top
SV5  [MA06-2]  113.67,141.6 270 top
SV6  [MA06-2]  118.75,141.6 270 top
SV7  [MA03-2]  108.11,13.97 90 top
SV8  [MA03-2]  76.04,13.97 90 top
T1  TIP125  [TO220]  5.07,195.41 0 top
T2  TIP125  [TO220]  24.76,195.41 0 top
TRIMPOT1  [MA03-2]  90.49,5.08 270 top
TRIMPOT2  [MA03-2]  46.51,13.18 270 top
U1  A3953  [SO16W]  27.78,52.7 180 top
U2  DRV8874  [HTSSOP16]  97.63,13.97 90 top
U3  BQ32000  [SO08]  14.22,174.08 180 top
U4  DRV8874  [HTSSOP16]  65.56,13.97 90 top
U5  A3953  [SO16W]  44.29,52.7 180 top
U6  TL1963A-33KTTR  [TL1963AKTTR]  26.5,111.77 180 top
U7  TL1963A-KTTR  [TL1963AKTTR]  6.82,133.36 0 top
U8  LM386  [DIL08]  26.04,82.08 180 top
U$1  MPU-9250-BB  [MPU-9250-BB]  95.89,54.77 270 top
U$2  GEARMOTOR_MOUNT  [GEARMOTOR_MOUNT]  127,13.34 0 top
U$3  GEARMOTOR_MOUNT  [GEARMOTOR_MOUNT]  17.78,13.34 0 bottom
U$4  CASTERWHEEL  [CASTERWHEEL]  73.03,174.62 90 top

## Tracks (layer width: path | path; a pad name or v marks a point on that pad's centre or on a via)
+5V
  Top 0.61: L1.P$61 49.58,102.31 52.02,102.31 J152.P$1 52.32,102.31 54.56,102.31 J152.P$2 54.86,102.31 57.1,102.31 J152.P$3 56.79,102.51 56.79,140.72 58.42,142.34 58.42,164.39 57.3,165.51 J103.P$3 57.1,165.81 54.86,165.81 J103.P$2 54.56,165.81 52.32,165.81 J103.P$1 52.02,165.81 49.58,165.81 L1.P$21 | 11.48,119.48 11.48,118.16 C8.1 | 11.48,119.48 14.43,122.43 R24.2 14.73,122.33 15.04,122.02 17.48,122.02 R26.2 17.58,122.33 17.58,126.09 S18.P$1 | U7.P$4 8.13,123.14 8.13,121.41 9.86,119.69 11.28,119.69 11.48,119.48 | SV2.4 3.15,53.95 3.15,51.51 SV2.2 3.45,51.51 5.69,51.51 SV2.1 5.69,51.82 5.69,53.95 SV2.3 | J200.P$1 J200.P$2 16.66,159.82 16.66,154.13 17.78,153.01 17.78,151.18 16.66,150.06 J203.P$2 J203.P$1 | S18.P$1 17.58,126.39 17.58,128.83 S18.P$2 17.58,129.13 17.58,131.37 S18.P$3 | S18.P$1 17.88,126.39 20.12,126.39 S17.P$1 20.12,126.69 20.12,128.83 S17.P$2 | S18.P$3 17.88,131.47 20.12,131.47 S17.P$3 20.12,131.78 20.12,133.91 S17.P$4 | S18.P$3 17.58,131.67 17.58,133.91 S18.P$4 17.58,134.21 17.58,136.45 S18.P$5 17.88,136.55 20.12,136.55 S17.P$5
  Bottom 0.61: 13.82,140.31 9.55,140.31 DCDC5V.3 | 13.82,140.31 17.58,136.55 S18.P$5 | J203.P$1 14.02,149.86 14.02,140.51 13.82,140.31 | SV2.4 3.15,54.05 3.15,54.66 1.83,55.98 1.83,100.18 6.2,104.55 10.16,104.55 16.97,111.35 16.97,125.68 17.58,126.29 S18.P$1 | L1.P$21 49.48,165.81 49.17,165.81 46.33,168.66 15.65,168.66 12.7,165.71 12.7,161.24 13.92,160.02 J200.P$1
ADCIN14
  Top 0.203: L1.P$23 49.58,160.73 52.02,160.73 J105.P$1 52.12,160.73 54.56,160.73 J105.P$2 54.66,160.73 57.1,160.73 J105.P$3
ADCIN15
  Top 0.203: L1.P$63 49.58,97.23 52.02,97.23 J150.P$1 52.12,97.23 54.56,97.23 J150.P$2 54.66,97.23 57.1,97.23 J150.P$3
ADCINA2
  Top 0.203: L1.P$29 49.58,145.49 52.02,145.49 J111.P$1 52.12,145.49 54.56,145.49 J111.P$2 54.66,145.49 57.1,145.49 J111.P$3
ADCINA3
  Top 0.203: L1.P$26 49.58,153.11 52.02,153.11 J108.P$1 52.12,153.11 54.56,153.11 J108.P$2 54.66,153.11 57.1,153.11 J108.P$3
ADCINA4
  Top 0.203: L1.P$69 49.58,81.99 52.02,81.99 J144.P$1 52.12,81.99 54.56,81.99 J144.P$2 54.66,81.99 57.1,81.99 J144.P$3
ADCINA5
  Top 0.203: L1.P$66 49.58,89.61 52.02,89.61 J147.P$1 52.12,89.61 54.56,89.61 J147.P$2 54.66,89.61 57.1,89.61 J147.P$3
ADCINB2
  Top 0.203: L1.P$28 49.58,148.03 52.02,148.03 J110.P$1 52.12,148.03 54.56,148.03 J110.P$2 54.66,148.03 57.1,148.03 J110.P$3
ADCINB3
  Top 0.203: L1.P$25 49.58,155.65 52.02,155.65 J107.P$1 52.12,155.65 54.56,155.65 J107.P$2 54.66,155.65 57.1,155.65 J107.P$3
ADCINB4
  Top 0.203: L1.P$68 49.58,84.53 52.02,84.53 J145.P$1 52.12,84.53 54.56,84.53 J145.P$2 54.66,84.53 57.1,84.53 J145.P$3
ADCINB5
  Top 0.203: L1.P$65 49.58,92.15 52.02,92.15 J148.P$1 52.12,92.15 54.56,92.15 J148.P$2 54.66,92.15 57.1,92.15 J148.P$3
ADCINC2
  Top 0.203: L1.P$27 49.58,150.57 52.02,150.57 J109.P$1 52.12,150.57 54.56,150.57 J109.P$2 54.66,150.57 57.1,150.57 J109.P$3
ADCINC3
  Top 0.203: L1.P$24 49.58,158.19 52.02,158.19 J106.P$1 52.12,158.19 54.56,158.19 J106.P$2 54.66,158.19 57.1,158.19 J106.P$3
ADCINC4
  Top 0.203: L1.P$67 49.58,87.07 52.02,87.07 J146.P$1 52.12,87.07 54.56,87.07 J146.P$2 54.66,87.07 57.1,87.07 J146.P$3
ADCINC5
  Top 0.203: L1.P$64 49.58,94.69 52.02,94.69 J149.P$1 52.12,94.69 54.56,94.69 J149.P$2 54.66,94.69 57.1,94.69 J149.P$3
DAC1
  Top 0.203: J114.P$1 82.6,145.49 85.04,145.49 J114.P$2 85.14,145.49 87.58,145.49 J114.P$3 87.68,145.49 90.12,145.49 L1.P$32
DAC2
  Top 0.203: J113.P$1 82.6,142.95 85.04,142.95 J113.P$2 85.14,142.95 87.58,142.95 J113.P$3 87.68,142.95 90.12,142.95 L1.P$31
DAC3
  Top 0.203: J252.P$1 62.89,113.08 65.33,113.08 J252.P$2 65.43,112.98 65.43,112.06 66.85,110.64 66.85,97.84 82.6,82.09 J141.P$1 82.6,81.99 85.04,81.99 J141.P$2 85.14,81.99 87.58,81.99 J141.P$3 87.68,81.99 90.12,81.99 L1.P$72
DAC4
  Top 0.203: J253.P$1 62.89,110.54 65.33,110.54 J253.P$2 | J142.P$1 82.6,79.45 85.04,79.45 J142.P$2 85.14,79.45 87.58,79.45 J142.P$3 87.68,79.45 90.12,79.45 L1.P$71
  Bottom 0.203: J253.P$2 65.43,110.44 65.43,109.53 66.85,108.1 66.85,95.1 82.5,79.45 J142.P$1
DACOUTA
  Top 0.203: L1.P$30 49.58,142.95 52.02,142.95 J112.P$1 52.12,142.95 54.56,142.95 J112.P$2 54.66,142.95 57.1,142.95 J112.P$3
DACOUTB
  Top 0.203: L1.P$70 49.58,79.45 52.02,79.45 J143.P$1 52.12,79.45 54.56,79.45 J143.P$2 54.66,79.45 57.1,79.45 J143.P$3
DRV1_DIR
  Top 0.203: U2.P$2 95.91,10.57 95.91,9.25 95.61,8.94 92.56,8.94 89.61,11.89 85.45,11.89 84.23,13.11 84.23,28.04 86.77,30.58 J80.P$1 86.87,30.68 89.31,30.68 J80.P$2
DRV1_M+
  Top 0.356: U2.P$8 99.91,9.31 100.33,9.53
  Top 0.762: 100.33,9.53 100.33,9.68
  Top 1.016: 100.33,9.68 109.38,9.68 SV7.1 SV7.3 SV7.5
DRV1_M-
  Top 0.356: U2.P$10 99.26,19.25 99.54,19.53
  Top 1.016: 99.54,19.53 102.55,19.37 105.41,16.51 SV7.6 SV7.4 SV7.2
DRV1_PWM  (via drill 0.51)
  Top 0.203: v94.49,11.48 95.3,10.67 U2.P$1 | J79.P$1 86.87,33.22 89.31,33.22 J79.P$2
  Bottom 0.203: v94.49,11.48 94.49,17.37 107.19,30.07 107.19,30.89 106.17,31.9 90.63,31.9 89.41,33.12 J79.P$2
DRV2_DIR  (via drill 0.51)
  Top 0.203: v62.38,9.55 62.99,8.94 63.6,8.94 63.91,9.25 63.91,10.57 U4.P$2 | v79.65,17.07 66.14,30.58 65.94,30.58 J83.P$2 65.84,30.68 63.4,30.68 J83.P$1
  Bottom 0.203: v62.38,9.55 62.38,14.12 65.84,17.58 79.15,17.58 v79.65,17.07
DRV2_M+
  Top 0.356: U4.P$8 67.84,9.47 68.26,9.37
  Top 1.016: 68.26,9.37 77.47,9.37 77.47,11.27 SV8.1 SV8.3 SV8.5
DRV2_M-
  Top 0.356: U4.P$10 67.19,19.09 67.63,19.53
  Top 1.016: 67.63,19.53 71.75,19.53 SV8.6 SV8.4 SV8.2
DRV2_PWM  (via drill 0.51)
  Top 0.203: v61.57,11.48 62.38,10.67 63.2,10.67 U4.P$1 | v57.1,17.07 56.39,17.07 53.44,20.02 53.44,21.74 62.18,30.48 62.18,32 63.3,33.12 J82.P$1 63.4,33.22 65.84,33.22 J82.P$2
  Bottom 0.203: v61.57,11.48 61.57,12.6 v57.1,17.07
GND  (via drill 0.51)
  Top 0.356: U2.P$16 95.36,13.97 U2.P$17 | U2.P$15 96.01,13.97 U2.P$17 | U2.P$9 99.91,13.97 U2.P$17 | U2.P$7 99.26,13.97 U2.P$17 | U4.P$16 63.29,14.18 63.5,13.97 | U4.P$15 63.94,14.17 64.14,13.97 | U4.P$9 67.84,14.08 67.94,13.97 | U4.P$7 67.19,13.93 67.15,13.97
  Top 0.61: U5.5 43.69,57.3 44.91,57.3 U5.4 | R7.1 43.59,62.79 43.59,60.35 C2.2 43.79,60.15 43.79,57.61 U5.5 | U5.11 42.47,48.16 43.59,48.16 U5.12 43.89,48.16 44.91,48.16 U5.13 | 39.32,52.02 38,52.02 JP3.2 | 39.32,52.02 42.47,48.87 42.47,48.46 U5.11 | C1.- 42.27,39.42 42.27,43.79 42.16,43.89 42.16,47.95 U5.11 | 39.32,52.02 43.59,56.29 43.59,57 U5.5 | 27.74,57.3 28.35,57.3 U1.4 | 27.74,57.3 27.23,57.3 U1.5 27.03,57 27.03,56.19 22.86,52.02 | 27.74,57.3 27.74,60.05 C14.2 27.64,60.35 27.64,62.79 R3.1 27.43,62.99 27.23,62.99 22.15,68.07 22.15,71.22 22.35,71.42 22.35,72.85 21.03,74.17 C7.- 20.93,74.47 20.93,83.41 20.32,84.02 | SV4.10 8.33,61.67 10.77,61.67 SV4.9 | U1.13 28.35,48.16 27.43,48.16 U1.12 27.13,48.16 25.91,48.16 U1.11 25.91,48.46 25.91,48.97 23.98,50.9 | 22.86,52.02 21.44,52.02 JP2.2 | 23.98,50.9 22.86,52.02 | 23.98,50.9 22.45,49.38 22.45,45.82 25.7,42.57 25.7,39.42 C13.- | U8.2 27.33,85.95 30.48,89.1 J9.P$2 30.48,89.41 30.48,91.54 J9.P$1 | SV4.26 8.33,81.99 10.77,81.99 SV4.25 11.07,81.99 16.97,81.99 18.8,83.82 C26.2 19.1,84.02 20.32,84.02 | 20.32,84.02 22.15,85.85 U8.4 | U6.P$6 26.72,111.76 26.72,101.8 20.42,95.5 M1.P$2 20.12,95.61 19.91,95.61 15.85,99.67 11.07,99.67 SV4.39 10.77,99.77 8.33,99.77 SV4.40 8.13,99.97 8.13,104.34 7.01,105.46 | L1.P$22 49.58,163.27 52.02,163.27 J104.P$1 52.32,163.27 54.56,163.27 J104.P$2 54.86,163.27 57.1,163.27 J104.P$3 | 13.51,175.16 12.39,176.28 12.39,177.09 U3.4 | 13.51,175.16 28.35,175.16 29.36,176.17 G1.- | SV2.30 3.25,87.07 5.69,87.07 SV2.29 | SV2.34 3.25,92.15 5.69,92.15 SV2.33 | SV2.30 3.05,87.27 3.05,87.78 1.83,89 1.83,90.63 3.05,91.85 SV2.34
  Top 0.61: SV2.13 5.69,66.75 3.25,66.75 SV2.14 3.05,66.95 3.05,67.46 1.83,68.68 1.83,72.85 3.05,74.07 SV2.20 | SV2.20 3.25,74.37 5.69,74.37 SV2.19 | SV2.30 2.95,86.77 2.95,86.06 1.83,84.94 1.83,75.79 3.05,74.57 SV2.20 | 7.01,105.46 4.37,105.46 POWER.1 4.17,105.16 1.83,102.82 1.83,94.08 3.05,92.86 3.05,92.35 SV2.34 | 7.01,105.46 8.94,107.39 J5.2 8.94,107.7 8.94,108.81 6.1,111.66 J5.3 5.89,111.96 5.79,112.06 5.79,117.86 C5.2 5.69,118.16 6.5,118.16 | 6.5,118.16 8.53,118.16 C8.2 | 6.5,118.16 6.5,123.14 U7.P$3 6.5,123.44 6.5,128.52 8.74,130.76 U7.P$6 | 25.3,136.45 25.3,134.01 LED_5V1.K | 25.3,136.45 27.23,138.38 DCDC3.3V.2 | 26.92,127.61 28.25,127.61 C3.2 28.55,127.71 29.97,129.13 32.11,129.13 32.31,128.93 34.75,128.93 LED_3.3V1.K | 26.92,127.61 25.4,127.61 C4.2 | 26.92,127.61 26.92,122.02 U6.P$3 | S129.P$5 S129.P$4 S129.P$3 S129.P$2 S129.P$1 | S137.P$5 S137.P$4 S137.P$3 | S137.P$3 S137.P$2 S137.P$1 11.58,147.52 12.7,148.64 12.7,153.01 11.58,154.13 11.58,157.28 S129.P$1 | U7.P$6 6.6,133.3 8.94,130.96 14.43,130.96 R25.1 14.43,131.27 14.43,135.23 17.07,137.87 20.62,137.87 21.84,136.65 25.09,136.65 25.3,136.45 | U7.P$6 6.91,133.4 6.91,140.31 DCDC5V.2 7.01,140.61 7.01,147.12 S137.P$3 | 13.51,175.16 13.31,174.96 13.31,174.55 5.08,166.32 5.08,165.2 6.4,163.88 11.99,163.88 12.7,163.17 12.7,158.8 11.58,157.68 S129.P$1 | L1.P$60 92.76,102.31 95.2,102.31 J153.P$1 95.5,102.31 97.74,102.31 J153.P$2 98.04,102.31 100.28,102.31 J153.P$3 | 89.81,115.72 84.02,115.72 81.99,117.75 81.99,118.57 IC4.7 81.89,118.87 v81.89,120.4 | 89.81,115.72 91.44,115.72 C11.2 91.64,115.93 92.86,117.14 92.86,127.31 91.44,128.73 C10.2
  Top 0.61: v81.89,129.95 81.89,131.98 IC3.7 | v89.81,115.52 89.81,115.72 | L1.P$62 49.58,99.77 52.02,99.77 J151.P$1 52.32,99.77 54.56,99.77 J151.P$2 54.86,99.77 57.1,99.77 J151.P$3 57.4,99.57 76.91,80.06 B2.P$2 77.11,79.76 77.11,68.48 81.08,64.52 81.08,63.91 J124.P$1 81.28,63.7 83.82,63.7 J124.P$2 84.02,63.7 86.36,63.7 J124.P$3 86.56,63.7 88.9,63.7 U$1.2 89,63.4 89,62.89 90.22,61.67 90.22,42.77 81.99,34.54 81.28,34.54 80.47,33.73 80.47,17.68 80.67,17.48 80.67,16.66 80.06,16.05 78.64,16.05 | TRIMPOT2.5 45.31,10.67 47.75,10.67 TRIMPOT2.6 48.06,10.67 52.73,10.67 | 52.73,10.67 52.73,12.19 v53.34,13.81 | 52.73,10.67 52.73,4.37 S159.P$1 | C25.- 56.9,14.12 C28.- | 78.64,6.6 78.64,16.05 | 78.64,16.05 78.64,17.07 74.17,21.54 71.02,21.54 C22.2 | 78.64,6.6 75.59,3.56 R43.2 | TRIMPOT1.6 TRIMPOT1.5 89,2.74 85.34,6.4 78.84,6.4 78.64,6.6 | v103.63,20.02 103.02,20.62 103.02,21.54 C16.2 103.33,21.54 105.36,21.54 112.98,29.16 140.11,29.16 141.33,30.38 S20.P$1 141.63,30.48 141.63,33.02 S20.P$2 141.63,33.22 141.63,35.56 S20.P$3 141.63,35.76 141.63,38.1 S20.P$4 141.63,38.3 141.63,40.64 S20.P$5 141.63,40.84 141.63,43.18 S20.P$6 141.63,43.38 141.63,45.72 S20.P$7 141.63,45.92 141.63,48.26 S20.P$8 141.63,48.46 141.63,50.8 S20.P$9 141.63,51 141.63,53.34 S20.P$10 141.63,53.54 141.63,55.88 S24.P$1 141.63,56.08 141.63,58.42 S24.P$2 141.63,58.62 141.63,60.96 S24.P$3 141.63,61.16 141.63,63.5 S24.P$4 141.63,63.7 141.63,66.04 S24.P$5 141.63,66.24 141.63,68.58 S24.P$6 141.63,68.78 141.63,71.12 S24.P$7 141.63,71.32 141.63,73.66 S24.P$8 141.63,73.86 141.63,76.2 S24.P$9 141.63,76.4 141.63,78.74 S24.P$10 141.63,78.94 141.63,81.28 S28.P$1 141.63,81.48 141.63,83.82 S28.P$2 141.63,84.02 141.63,86.36 S28.P$3 141.63,86.56 141.63,88.9 S28.P$4 141.63,89.1 141.63,91.44 S28.P$5 141.63,91.64 141.63,93.98 S28.P$6 141.63,94.18 141.63,96.52 S28.P$7 141.63,96.72 141.63,99.06 S28.P$8 141.63,99.26 141.63,101.6 S28.P$9 141.63,101.8 141.63,104.14 S28.P$10 141.63,104.34 141.63,106.68 S27.P$1 141.63,106.88 141.63,109.22 S27.P$2 141.63,109.42 141.63,111.76 S27.P$3 141.63,111.96 141.63,114.3 S27.P$4 141.63,114.5 141.63,116.84 S27.P$5 141.63,117.04 141.63,119.38 S27.P$6 141.63,119.58 141.63,121.92 S27.P$7 141.63,122.12 141.63,124.46 S27.P$8 141.63,124.66 141.63,127 S27.P$9 141.63,127.2 141.63,129.54 S27.P$10 141.43,129.74 134.42,136.75 134.42,145.29 134.21,145.49
  Top 0.61: v102.72,8.43 107.59,3.56 R41.2 | v93.67,176.48 92.86,177.29 92.15,177.29 C9.2 | v86.87,188.67 88.19,189.99 92.05,189.99 C6.2 | v83.41,181.97 82.6,181.15 82.6,180.24 IC2.7 | v83.52,191.11 82.6,192.02 82.6,192.94 IC1.7 | J64.P$1 122.63,145.49 125.07,145.49 J64.P$2 125.37,145.49 134.21,145.49 | B1.P$2 138.58,149.86 134.21,145.49 | v52.73,30.68 52.73,15.54 53.34,13.89
  Top 3.302: C20.- 99.82,14.05 99.91,13.97
  Top 3.556: v86.36,13.97 86.44,14.05 C20.- | v53.34,13.81 53.34,13.89 C28.- 56.83,13.97 63.5,13.97 64.14,13.97 U4.P$17 67.15,13.97 67.94,13.97
  Bottom 0.61: C15.- 42.27,39.62 42.27,43.38 38,47.65 38,52.02 JP3.2 | SV4.9 10.87,61.57 11.99,61.57 21.23,52.32 JP2.2 21.44,52.02 21.44,47.14 25.7,42.88 25.7,39.62 C12.- 26.01,39.32 27.64,37.69 34.24,37.69 36.17,39.62 41.96,39.62 C15.- | 22.15,87.07 22.15,85.95 U8.4 | 22.15,87.07 22.15,90.22 20.42,91.95 20.42,95.4 M1.P$2 | 22.15,87.07 25.3,87.07 26.42,85.95 27.23,85.95 U8.2 | 25.3,186.84 13.11,186.84 10.97,188.98 7.62,188.98 T1.3 | 25.3,186.84 27.23,188.77 27.23,188.98 T2.3 | J104.P$1 52.02,163.27 52.02,163.98 50.8,165.2 50.8,166.73 41.35,176.17 29.46,176.17 G1.- 29.36,176.48 25.5,180.34 25.5,186.64 25.3,186.84 | LED_5V1.K 25.3,133.91 29.77,133.91 34.75,128.93 LED_3.3V1.K | v81.89,120.4 v81.89,129.95 | v89.81,115.52 92.66,112.67 92.66,102.31 L1.P$60 | J153.P$2 97.74,102.21 97.74,101.5 96.52,100.28 96.52,71.22 89,63.7 U$1.2 | v103.63,20.02 97.64,14.02 U2.P$17 97.74,13.72 102.72,8.74 v102.72,8.43 | TRIMPOT1.5 89.2,2.54 89.2,3.25 87.88,4.57 87.88,12.29 C27.- | U4.P$17 65.63,14.02 72.95,14.02 74.17,15.24 84.53,15.24 84.84,14.94 v86.36,13.97 | 93.67,166.73 v93.67,176.48 90.93,179.22 88.9,179.22 86.87,181.25 86.87,181.97 | 93.67,166.73 92.76,165.81 L1.P$20 | 86.87,181.97 v86.87,188.67 84.43,191.11 v83.52,191.11 | 86.87,181.97 v83.41,181.97 | 93.67,166.73 94.59,165.81 95.2,165.81 J102.P$1 95.5,165.81 97.74,165.81 J102.P$2 98.04,165.81 100.28,165.81 J102.P$3 100.48,165.51 100.48,164.9 103.23,162.15 103.23,159.51 113.49,149.25 125.68,149.25 126.39,148.54 126.39,146.71 J64.P$2 | v52.73,30.68 43.99,39.42 42.57,39.42 C15.-
  Bottom 3.556: C27.- 88.83,13.97 v86.36,13.97 | v53.34,13.81 56.83,13.81 C28.-
  pour Top: 0,0 0,198.12 144.78,198.12 144.78,0
  pour Bottom: 0,0 0,198.12 144.78,198.12 144.78,0
GPIO0
  Top 0.203: J122.P$1 82.6,165.81 85.04,165.81 J122.P$2 85.14,165.81 87.58,165.81 J122.P$3 87.68,165.81 90.12,165.81 L1.P$40
GPIO1
  Top 0.203: J121.P$1 82.6,163.27 85.04,163.27 J121.P$2 85.14,163.27 87.58,163.27 J121.P$3 87.68,163.27 90.12,163.27 L1.P$39
GPIO2  (via drill 0.51)
  Top 0.203: L1.P$38 90.12,160.73 87.68,160.73 J120.P$3 87.58,160.73 85.14,160.73 J120.P$2 85.04,160.73 82.6,160.73 J120.P$1 | J198.P$1 11.68,41.76 J198.P$2 | v54.36,77.93 v52.53,76.1 | v59.54,120.19 59.54,134.11 72.03,146.61 v81.69,146.61
  Bottom 0.203: v52.53,76.1 39.42,62.99 10.67,62.99 9.65,61.98 9.65,44.7 11.58,42.77 J198.P$1 | v54.36,77.93 54.76,77.93 56.08,79.25 56.08,116.74 v59.54,120.19 | v81.69,146.61 82.8,146.61 84.02,147.83 84.02,159.61 85.04,160.63 J120.P$2
GPIO3
  Top 0.203: J119.P$1 82.6,158.19 85.04,158.19 J119.P$2 85.14,158.19 87.58,158.19 J119.P$3 87.68,158.19 90.12,158.19 L1.P$37 | J199.P$1 11.68,44.3 J199.P$2
  Bottom 0.203: J199.P$2 14.22,44.2 15.24,44.2 16.56,42.88 19.61,42.88 23.67,38.81 23.67,38.2 25.91,35.97 46.33,35.97 55.58,26.72 81.89,26.72 85.75,30.58 85.75,31.09 86.77,32.11 87.27,32.11 88.29,33.12 88.29,40.54 99.26,51.51 99.26,126.9 102.92,130.56 102.92,157.07 100.48,159.51 99.77,159.51 99.47,159.82 98.55,159.82 97.94,159.21 91.24,159.21 90.22,158.19 L1.P$37
GPIO4
  Top 0.203: J238.P$1 59.74,173.43 62.18,173.43 J238.P$2 62.28,173.33 62.28,172.31 63.7,170.89 63.7,167.74 73.36,158.09 80.06,158.09 82.5,155.65 J118.P$1 82.6,155.65 85.04,155.65 J118.P$2 85.14,155.65 87.58,155.65 J118.P$3 87.68,155.65 90.12,155.65 L1.P$36
GPIO5
  Top 0.203: J239.P$1 59.74,170.89 62.18,170.89 J239.P$2 62.28,170.79 62.28,169.77 63.3,168.76 63.3,167.54 73.15,157.68 77.93,157.68 82.5,153.11 J117.P$1 82.6,153.11 85.04,153.11 J117.P$2 85.14,153.11 87.58,153.11 J117.P$3 87.68,153.11 90.12,153.11 L1.P$35
GPIO6  (via drill 0.51)
  Top 0.203: J240.P$1 59.74,168.35 62.18,168.35 J240.P$2 62.28,168.25 62.28,159.72 v72.85,149.15 | J133.P$1 82.6,102.31 85.04,102.31 J133.P$2 85.14,102.31 87.58,102.31 J133.P$3 87.68,102.31 90.12,102.31 L1.P$80
  Bottom 0.203: v72.85,149.15 72.85,140.11 86.67,126.29 86.67,108.31 90.12,104.85 90.12,102.31 L1.P$80
GPIO7
  Top 0.203: J242.P$1 62.89,135.94 65.33,135.94 J242.P$2 | J134.P$1 82.6,99.77 85.04,99.77 J134.P$2 85.14,99.77 87.58,99.77 J134.P$3 87.68,99.77 90.12,99.77 L1.P$79
  Bottom 0.203: J242.P$2 65.43,135.84 65.43,134.93 66.85,133.5 66.85,130.35 67.87,129.34 68.48,129.34 69.39,128.42 69.39,125.27 70.41,124.26 71.02,124.26 78.74,116.53 78.74,107.59 81.48,104.85 81.48,100.79 82.5,99.77 J134.P$1
GPIO8
  Top 0.203: J243.P$1 62.89,133.4 65.33,133.4 J243.P$2 | J135.P$1 82.6,97.23 85.04,97.23 J135.P$2 85.14,97.23 87.58,97.23 J135.P$3 87.68,97.23 90.12,97.23 L1.P$78
  Bottom 0.203: J243.P$2 65.33,133.3 65.33,132.28 64.31,131.27 64.31,115.11 65.33,114.1 65.94,114.1 66.85,113.18 66.85,112.57 67.87,111.56 68.48,111.56 69.39,110.64 69.39,110.03 70.41,109.02 71.02,109.02 79.45,100.58 79.45,96.11 82.09,93.47 83.01,93.47 83.62,94.08 83.62,96.11 82.6,97.13 J135.P$1
GPIO9
  Top 0.203: J244.P$1 62.89,130.86 65.33,130.86 J244.P$2 | J136.P$1 82.6,94.69 85.04,94.69 J136.P$2 85.14,94.69 87.58,94.69 J136.P$3 87.68,94.69 90.12,94.69 L1.P$77
  Bottom 0.203: J244.P$2 65.43,130.76 65.43,129.84 66.85,128.42 66.85,125.27 67.87,124.26 68.48,124.26 69.39,123.34 69.39,120.19 70.41,119.18 71.02,119.18 78.33,111.86 78.33,107.39 81.08,104.65 81.08,96.11 82.5,94.69 J136.P$1
GPIO10
  Top 0.203: J137.P$1 82.6,92.15 85.04,92.15 J137.P$2 85.14,92.15 87.58,92.15 J137.P$3 87.68,92.15 90.12,92.15 L1.P$76 90.22,92.05 91.24,91.03 91.24,78.84 101.09,68.99 101.09,52.73 84.23,35.87 84.23,33.33 J84.P$2 84.23,33.22 81.79,33.22 J84.P$1
GPIO11
  Top 0.203: J138.P$3 87.68,89.61 90.12,89.61 L1.P$75 | J86.P$1 58.32,33.22 60.76,33.22 J86.P$2 | J138.P$1 82.6,89.61 85.04,89.61 J138.P$2
  Bottom 0.203: 86.11,88.54 85.14,89.51 J138.P$2 | 86.11,88.54 86.16,88.49 86.16,78.84 60.86,53.54 60.86,33.22 J86.P$2 | 86.11,88.54 87.07,89.51 87.58,89.51 J138.P$3
GPIO14  (via drill 0.51)
  Top 0.203: J201.P$2 J201.P$1 | J139.P$1 82.6,87.07 85.04,87.07 J139.P$2 85.14,87.07 87.58,87.07 J139.P$3 87.68,87.07 90.12,87.07 L1.P$74 | v37.9,80.26 37.9,79.25 45.82,71.32 v54.15,71.32
  Bottom 0.203: v37.9,80.26 37.9,99.97 22.35,115.52 22.35,135.94 15.44,142.85 15.44,160.53 16.46,161.54 16.46,162.56 J201.P$2 | v54.15,71.32 76.71,71.32 84.02,78.64 84.02,85.95 85.04,86.97 J139.P$2
GPIO15  (via drill 0.51)
  Top 0.203: J202.P$2 J202.P$1 | J140.P$1 82.6,84.53 85.04,84.53 J140.P$2 85.14,84.53 87.58,84.53 J140.P$3 87.68,84.53 90.12,84.53 L1.P$73 | v58.93,80.77 v51.1,80.77
  Bottom 0.203: v51.1,80.77 38.91,80.77 38.3,81.38 38.3,100.18 22.76,115.72 22.76,145.19 16.56,151.38 16.56,152.4 J202.P$2 | v58.93,80.77 60.45,80.77 63.09,78.13 82.91,78.13 83.62,78.84 83.62,83.41 82.6,84.43 J140.P$1
GPIO16
  Top 0.203: L1.P$33 90.12,148.03 87.68,148.03 J115.P$3 87.58,148.03 85.14,148.03 J115.P$2 85.04,148.03 82.6,148.03 J115.P$1 82.5,147.93 72.75,147.93 58.73,133.91 58.73,110.54 62.89,106.38 62.89,105.56 J251.P$1 62.89,105.46 65.33,105.46 J251.P$2
GPIO18
  Top 0.203: J16.P$1 39.42,158.19 41.86,158.19 J16.P$2 41.96,158.19 44.4,158.19 J16.P$3 44.5,158.19 46.94,158.19 L1.P$4
GPIO19
  Top 0.203: J15.P$1 39.42,160.73 41.86,160.73 J15.P$2 41.96,160.73 44.4,160.73 J15.P$3 44.5,160.73 46.94,160.73 L1.P$3
GPIO22
  Top 0.203: J210.P$1 59.74,196.29 62.18,196.29 J210.P$2 | J20.P$1 39.42,148.03 41.86,148.03 J20.P$2 41.96,148.03 44.4,148.03 J20.P$3 44.5,148.03 46.94,148.03 L1.P$8
  Bottom 0.203: J210.P$1 59.74,196.19 59.74,195.17 60.76,194.16 60.76,172.82 59.84,171.91 59.23,171.91 53.54,166.22 53.54,155.45 52.22,154.13 51.61,154.13 50.6,153.11 50.6,152.5 49.68,151.59 49.07,151.59 48.06,150.57 48.06,149.05 47.04,148.03 L1.P$8
GPIO24  (via drill 0.51)
  Top 0.203: L1.P$34 90.12,150.57 87.68,150.57 J116.P$3 87.58,150.57 85.14,150.57 J116.P$2 85.04,150.57 82.6,150.57 J116.P$1 | J245.P$1 62.89,128.32 65.33,128.32 J245.P$2 65.33,128.42 65.33,129.13 66.85,130.66 66.85,131.27 67.87,132.28 73.86,132.28 v77.83,136.25
  Bottom 0.203: v77.83,136.25 77.83,145.8 82.5,150.47 J116.P$1
GPIO25  (via drill 0.51)
  Top 0.203: J246.P$1 62.89,125.78 65.33,125.78 J246.P$2 | J162.P$3 100.28,79.45 97.84,79.45 J162.P$2 97.74,79.45 95.3,79.45 J162.P$1 95.2,79.45 92.76,79.45 L1.P$51 92.76,79.55 91.64,80.67 91.64,92.15 90.63,93.17 82.4,93.17 80.26,95.3 v80.26,96.42
  Bottom 0.203: v80.26,96.42 80.26,104.85 71.02,114.1 70.41,114.1 69.39,115.11 69.39,118.26 68.48,119.18 67.87,119.18 66.85,120.19 66.85,123.34 65.43,124.77 65.43,125.68 J246.P$2
GPIO26  (via drill 0.51)
  Top 0.203: J247.P$2 65.33,123.24 62.89,123.24 J247.P$1 62.79,123.14 62.79,122.12 61.77,121.11 v61.77,116.53 | L1.P$53 92.76,84.53 95.2,84.53 J160.P$1 95.3,84.53 97.74,84.53 J160.P$2 97.84,84.53 100.28,84.53 J160.P$3
  Bottom 0.203: v61.77,116.53 61.77,115.11 62.79,114.1 63.4,114.1 64.31,113.18 64.31,112.57 65.33,111.56 65.94,111.56 66.85,110.64 66.85,110.03 67.87,109.02 68.48,109.02 69.39,108.1 69.39,103.63 82.4,90.63 93.17,90.63 93.78,90.02 93.78,85.55 92.76,84.53 L1.P$53
GPIO27  (via drill 0.51)
  Top 0.203: J248.P$1 62.89,120.7 65.33,120.7 J248.P$2 | L1.P$52 92.76,81.99 95.2,81.99 J161.P$1 95.3,81.99 97.74,81.99 J161.P$2 97.84,81.99 100.28,81.99 J161.P$3 100.28,82.09 101.4,83.21 101.4,92.56 100.79,93.17 92.56,93.17 91.64,94.08 91.64,94.69 90.63,95.71 82.4,95.71 79.45,98.65 v79.45,103.12
  Bottom 0.203: v79.45,103.12 71.02,111.56 70.41,111.56 69.39,112.57 69.39,113.18 68.48,114.1 67.87,114.1 66.85,115.11 66.85,118.26 65.43,119.69 65.43,120.6 J248.P$2
GPIO29
  Top 0.203: J29.P$3 100.28,142.95 97.84,142.95 J29.P$2 97.74,142.95 95.3,142.95 J29.P$1 95.2,142.95 92.76,142.95 L1.P$11 | J85.P$1 81.79,30.68 84.23,30.68 J85.P$2
  Bottom 0.203: J85.P$2 84.33,30.68 84.33,31.7 85.75,33.12 85.75,38.61 98.86,51.71 98.86,112.47 88.19,123.14 88.19,129.84 92.66,134.31 92.66,142.85 L1.P$11
GPIO32
  Top 0.203: J87.P$1 58.32,30.68 60.76,30.68 J87.P$2 | J14.P$1 39.42,163.27 41.86,163.27 J14.P$2 41.96,163.27 44.4,163.27 J14.P$3 44.5,163.27 46.94,163.27 L1.P$2
  Bottom 0.203: J87.P$1 58.22,30.68 58.22,31.7 53.34,36.58 53.34,128.02 45.52,135.84 45.52,162.15 44.5,163.17 J14.P$3
GPIO40
  Top 0.203: J208.P$1 1.32,165.81 3.76,165.81 J208.P$2 | J163.P$1 39.42,79.45 41.86,79.45 J163.P$2 41.96,79.45 44.4,79.45 J163.P$3 44.5,79.45 46.94,79.45 L1.P$50
  Bottom 0.203: J208.P$2 3.86,165.71 3.86,164.08 5.28,162.66 5.28,143.56 8.43,140.41 8.43,136.55 17.48,127.51 18.09,127.51 19,126.59 19,118.26 37.08,100.18 37.08,79.96 37.59,79.45 39.32,79.45 J163.P$1
GPIO41
  Top 0.203: J209.P$1 14.63,165.81 17.07,165.81 J209.P$2 | J164.P$1 39.42,81.99 41.86,81.99 J164.P$2 41.96,81.99 44.4,81.99 J164.P$3 44.5,81.99 46.94,81.99 L1.P$49
  Bottom 0.203: J209.P$2 17.17,165.71 17.17,163.47 22.76,157.89 22.76,148.44 37.8,133.4 37.8,112.17 40.44,109.53 40.44,83.01 39.42,81.99 J164.P$1
GPIO52
  Top 0.203: J211.P$2 62.18,193.75 59.74,193.75 J211.P$1 59.64,193.65 59.64,192.63 34.14,167.13 34.14,142.34 32.51,140.72 32.51,133.81 37.49,128.83 37.49,117.96 38.3,117.14 38.3,85.75 39.42,84.63 J165.P$1 39.42,84.53 41.86,84.53 J165.P$2 41.96,84.53 44.4,84.53 J165.P$3 44.5,84.53 46.94,84.53 L1.P$48
GPIO56
  Top 0.203: J169.P$1 39.42,94.69 41.86,94.69 J169.P$2 41.96,94.69 44.4,94.69 J169.P$3 44.5,94.69 46.94,94.69 L1.P$44
GPIO58
  Top 0.203: L1.P$15 92.76,153.11 95.2,153.11 J33.P$1 95.3,153.11 97.74,153.11 J33.P$2 97.84,153.11 100.28,153.11 J33.P$3
GPIO59
  Top 0.203: L1.P$14 92.76,150.57 95.2,150.57 J32.P$1 95.3,150.57 97.74,150.57 J32.P$2 97.84,150.57 100.28,150.57 J32.P$3
GPIO60
  Top 0.203: J249.P$1 62.89,118.16 65.33,118.16 J249.P$2 | J19.P$1 39.42,150.57 41.86,150.57 J19.P$2 41.96,150.57 44.4,150.57 J19.P$3 44.5,150.57 46.94,150.57 L1.P$7
  Bottom 0.203: J249.P$1 62.79,118.16 62.79,119.18 45.92,136.04 45.92,149.45 46.94,150.47 L1.P$7
GPIO61  (via drill 0.51)
  Top 0.203: J101.P$3 100.28,163.27 97.84,163.27 J101.P$2 97.74,163.27 95.3,163.27 J101.P$1 95.2,163.27 92.76,163.27 L1.P$19 92.66,163.17 91.64,162.15 91.64,152.91 90.63,151.89 82.4,151.89 78.84,148.34 72.54,148.34 57.91,133.71 v57.91,122.94 | J250.P$1 62.89,115.62 65.33,115.62 J250.P$2
  Bottom 0.203: v57.91,122.94 60.35,120.5 60.35,119.08 62.79,116.64 62.79,115.62 J250.P$1
GPIO63
  Top 0.203: J158.P$3 100.28,89.61 97.84,89.61 J158.P$2 97.74,89.61 95.3,89.61 J158.P$1 95.2,89.61 92.76,89.61 L1.P$55 | J204.P$1 76.2,58.62 78.74,58.62 J204.P$2
  Bottom 0.203: J204.P$2 78.74,59.54 80.16,60.96 80.16,72.24 86.56,78.64 86.56,82.4 87.48,83.31 88.09,83.31 89.1,84.33 89.1,84.94 90.02,85.85 90.63,85.85 91.64,86.87 91.64,88.49 92.66,89.51 L1.P$55
GPIO64
  Top 0.203: J159.P$3 100.28,87.07 97.84,87.07 J159.P$2 97.74,87.07 95.3,87.07 J159.P$1 95.2,87.07 92.76,87.07 L1.P$54 | J205.P$1 76.2,51 78.74,51 J205.P$2